# EAGLE design board (EAGLE 9.2.0)
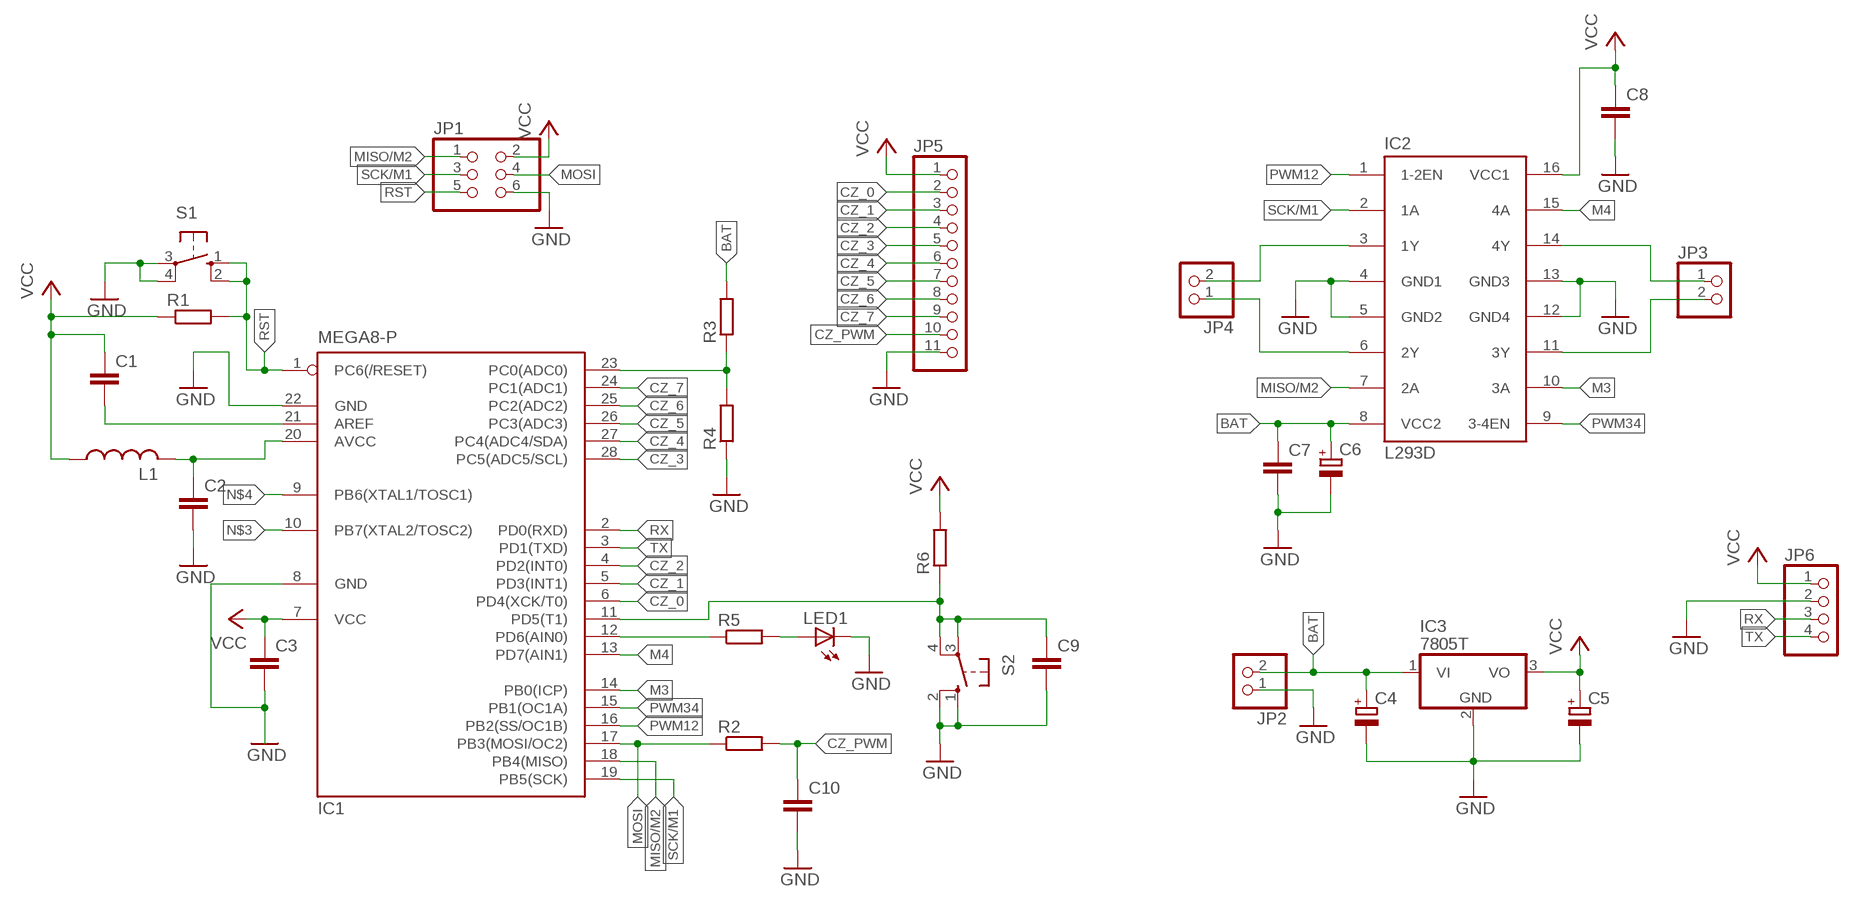
[diagram p0: schematic, sheet 1]

## Parts
C1  C-EU025-025X050  [C025-025X050]
C2  C-EU025-025X050  [C025-025X050]
C3  C-EU025-025X050  [C025-025X050]
C4  CPOL-EUE2-5  [E2-5]
C5  CPOL-EUE2-5  [E2-5]
C6  CPOL-EUE2-5  [E2-5]
C7  C-EU025-025X050  [C025-025X050]
C8  C-EU025-025X050  [C025-025X050]
C9  C-EU025-025X050  [C025-025X050]
C10  C-EU050-035X075  [C050-035X075]
IC1  MEGA8-P  [DIL28-3]
IC2  L293D  [DIL16]
IC3  7805T  [TO220H]
JP1  PINHD-2X3  [2X03]
JP2  PINHD-1X2  [1X02]
JP3  PINHD-1X2  [1X02]
JP4  PINHD-1X2  [1X02]
JP5  PINHD-1X11  [1X11]
JP6  PINHD-1X4  [1X04]
L1  L-US0204/7  [0204/7]
LED1  LED5MM  [LED5MM]
R1  R-EU_0207/7  [0207/7]
R2  R-EU_0207/7  [0207/7]
R3  R-EU_0207/7  [0207/7]
R4  R-EU_0207/7  [0207/7]
R5  R-EU_0207/7  [0207/7]
R6  R-EU_0207/7  [0207/7]
S1  10-XX  [B3F-10XX]
S2  10-XX  [B3F-10XX]

## Nets
BAT: C4.+ C6.+ C7.1 IC2.8(VCC2) IC3.1(VI) JP2.2 R3.2
CZ_0: IC1.6(PD4(XCK/T0)) JP5.2
CZ_1: IC1.5(PD3(INT1)) JP5.3
CZ_2: IC1.4(PD2(INT0)) JP5.4
CZ_3: IC1.28(PC5(ADC5/SCL)) JP5.5
CZ_4: IC1.27(PC4(ADC4/SDA)) JP5.6
CZ_5: IC1.26(PC3(ADC3)) JP5.7
CZ_6: IC1.25(PC2(ADC2)) JP5.8
CZ_7: IC1.24(PC1(ADC1)) JP5.9
CZ_PWM: C10.1 JP5.10 R2.2
GND: C2.2 C3.2 C4.- C5.- C6.- C7.2 C8.2 C9.2 C10.2 IC1.8(GND) IC1.22(GND) IC2.4(GND1) IC2.5(GND2) IC2.12(GND4) IC2.13(GND3) IC3.2(GND) JP1.6 JP2.1 JP5.11 JP6.2 LED1.K(C) R4.1 S1.3(P) S1.4(P1) S2.1(S) S2.2(S1)
M3: IC1.14(PB0(ICP)) IC2.10(3A)
M4: IC1.13(PD7(AIN1)) IC2.15(4A)
MISO/M2: IC1.18(PB4(MISO)) IC2.7(2A) JP1.1
MOSI: IC1.17(PB3(MOSI/OC2)) JP1.4 R2.1
N$1: IC2.11(3Y) JP3.2
N$2: IC2.14(4Y) JP3.1
N$3: IC1.10(PB7(XTAL2/TOSC2))
N$4: IC1.9(PB6(XTAL1/TOSC1))
N$5: C2.1 IC1.20(AVCC) L1.2
N$6: LED1.A R5.2
N$7: IC2.3(1Y) JP4.2
N$8: IC2.6(2Y) JP4.1
N$9: C1.2 IC1.21(AREF)
N$21: IC1.12(PD6(AIN0)) R5.1
N$22: C9.1 IC1.11(PD5(T1)) R6.1 S2.3(P) S2.4(P1)
N$33: IC1.23(PC0(ADC0)) R3.1 R4.2
PWM12: IC1.16(PB2(SS/OC1B)) IC2.1(1-2EN)
PWM34: IC1.15(PB1(OC1A)) IC2.9(3-4EN)
RST: IC1.1(PC6(/RESET)) JP1.5 R1.2 S1.1(S) S1.2(S1)
RX: IC1.2(PD0(RXD)) JP6.3
SCK/M1: IC1.19(PB5(SCK)) IC2.2(1A) JP1.3
TX: IC1.3(PD1(TXD)) JP6.4
VCC: C1.1 C3.1 C5.+ C8.1 IC1.7(VCC) IC2.16(VCC1) IC3.3(VO) JP1.2 JP5.1 JP6.1 L1.1 R1.1 R6.2

## Library data of the parts
C1-C3 C7-C10 = rcl:C-EU: CAPACITOR, European symbol; SPICEPREFIX: C
C4-C6 = rcl:CPOL-EU: POLARIZED CAPACITOR, European symbol; SPICEPREFIX: C
IC1 = atmel:MEGA8-P: MICROCONTROLLER 8 Kbytes FLASH, 1 kbytes SRAM, 512 bytes EEPROM, USART, 4-channel 10 bit ADC, 2-channel 8 bit ADC Pin compatible with Atmega48, ATMega88, ATMega168 Source: avr.lbr; OC_FARNELL: unknown; OC_NEWARK: unknown
IC2 = st-microelectronics:L293D: PUSH-PULL 4 CHANNEL DRIVER; MPN: L293D; OC_FARNELL: 9589619; OC_NEWARK: 56P8249
IC3 = Comparators,LM339:78*: Positive VOLTAGE REGULATOR Source: http://cache.national.com/ds/LM/LM78L05.pdf http://www.fairchildsemi.com/ds/LM/LM7805.pdf
JP1 = pinhead:PINHD-2X3: PIN HEADER
JP2-JP4 = pinhead:PINHD-1X2: PIN HEADER
JP5 = pinhead:PINHD-1X11: PIN HEADER
JP6 = pinhead:PINHD-1X4: PIN HEADER
L1 = rcl:L-US: INDUCTOR, American symbol; SPICEPREFIX: L
LED1 = led:LED: LED OSRAM: - CHIPLED LG R971, LG N971, LY N971, LG Q971, LY Q971, LO R971, LY R971 LH N974, LH R974 LS Q976, LO Q976, LY Q976 LO Q996 - Hyper CHIPLED LW Q18S LB Q993, LB Q99A, LB R99A - SideLED LS A670, LO A670, LY A670, LG A670, LP A670 LB A673, LV A673, LT A673, LW A673 LH A674 LY A675 LS A676, LA A676, LO A676, LY A676, LW A676 LS A679, LY A679, LG A679 - Hyper Micro SIDELED® LS Y876, LA Y876, LO Y876, LY Y876 LT Y87S - SmartLED LW L88C, LW L88S LB L89C, LB L89S, LG L890 LS L89K, LO L89K, LY L89K LS L896, LA L896, LO L896, LY L896 - TOPLED LS T670, LO T670, LY T670, LG T670, LP T670 LSG T670, LSP T670, LSY T670, LOP T670, LYG T670 LG T671, LOG T671, LSG T671 LB T673, LV T673, LT T673, LW T673 LH T674 LS T676, LA T676, LO T676, LY T676, LB T676, LH T676, LSB T676, LW T676 LB T67C, LV T67C, LT T67C, LS T67K, LO T67K, LY T67K, LW E67C LS E67B, LA E67B, LO E67B, LY E67B, LB E67C, LV E67C, LT E67C LW T67C LS T679, LY T679, LG T679 LS T770, LO T770, LY T770, LG T770, LP T770 LB T773, LV T773, LT T773, LW T773 LH T774 LS E675, LA E675, LY E675, LS T675 LS T776, LA T776, LO T776, LY T776, LB T776 LHGB T686 LT T68C, LB T68C - Hyper Mini TOPLED® LB M676 - Mini TOPLED Santana® LG M470 LS M47K, LO M47K, LY M47K Source: http://www.osram.convergy.de LUXEON: - LUMILED® LXK2-PW12-R00, LXK2-PW12-S00, LXK2-PW14-U00, LXK2-PW14-V00 LXK2-PM12-R00, LXK2-PM12-S00, LXK2-PM14-U00 LXK2-PE12-Q00, LXK2-PE12-R00, LXK2-PE12-S00, LXK2-PE14-T00, LXK2-PE14-U00 LXK2-PB12-K00, LXK2-PB12-L00, LXK2-PB12-M00, LXK2-PB14-N00, LXK2-PB14-P00, LXK2-PB14-Q00 LXK2-PR12-L00, LXK2-PR12-M00, LXK2-PR14-Q00, LXK2-PR14-R00 LXK2-PD12-Q00, LXK2-PD12-R00, LXK2-PD12-S00 LXK2-PH12-R00, LXK2-PH12-S00 LXK2-PL12-P00, LXK2-PL12-Q00, LXK2-PL12-R00 Source: www.luxeon.com KINGBRIGHT: KA-3528ASYC Source: www.kingbright.com
R1-R6 = rcl:R-EU_: RESISTOR, European symbol; SPICEPREFIX: R
S1 S2 = switch-omron:10-XX: OMRON SWITCH; MPN: B3F-1000; OC_FARNELL: 176432; OC_NEWARK: 36M3542

## Board
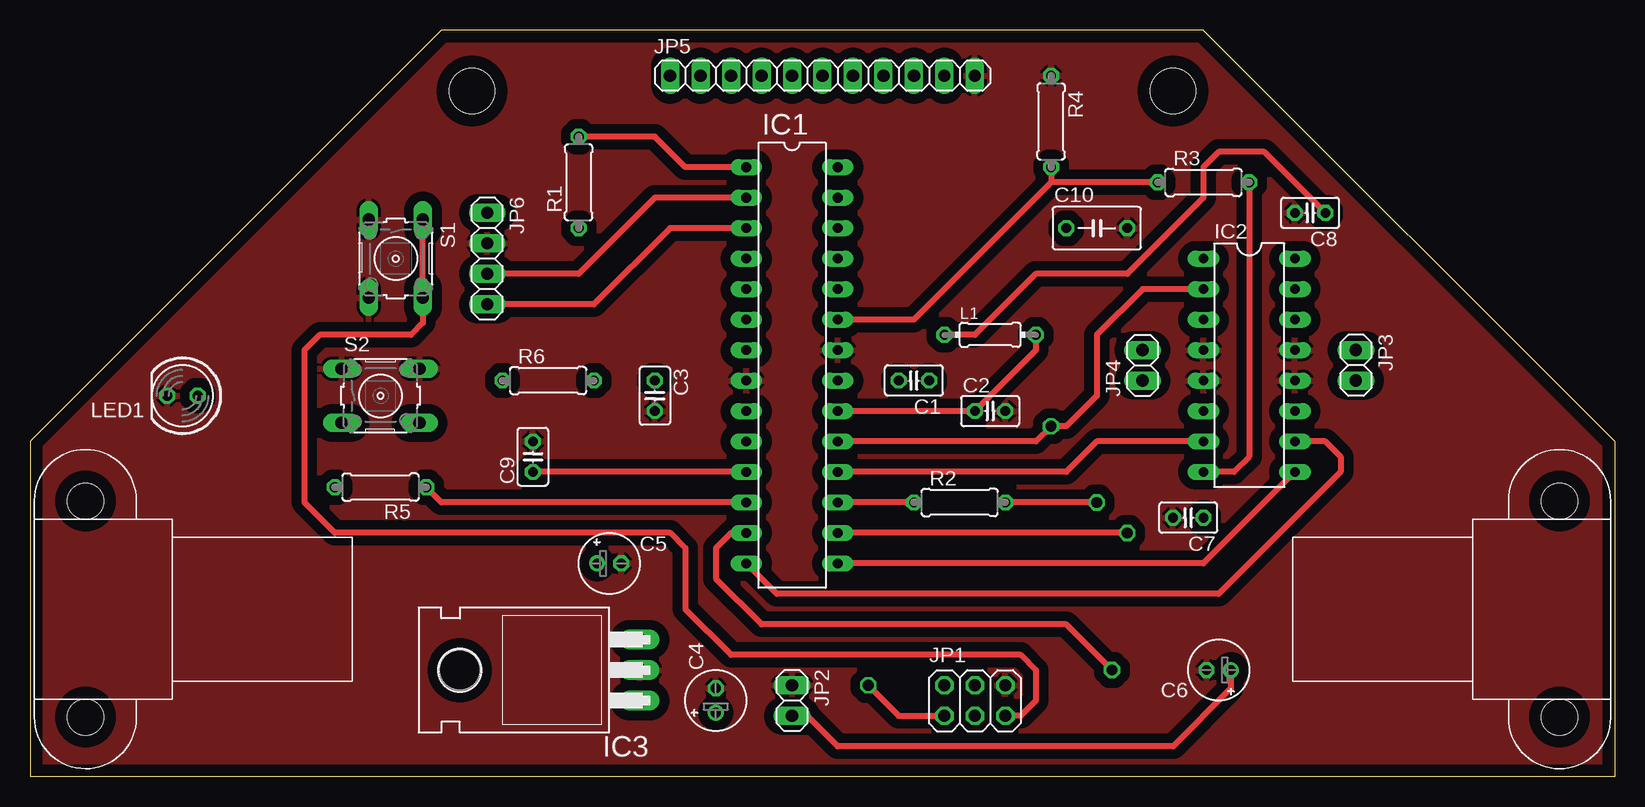
[diagram p1: board, top side]
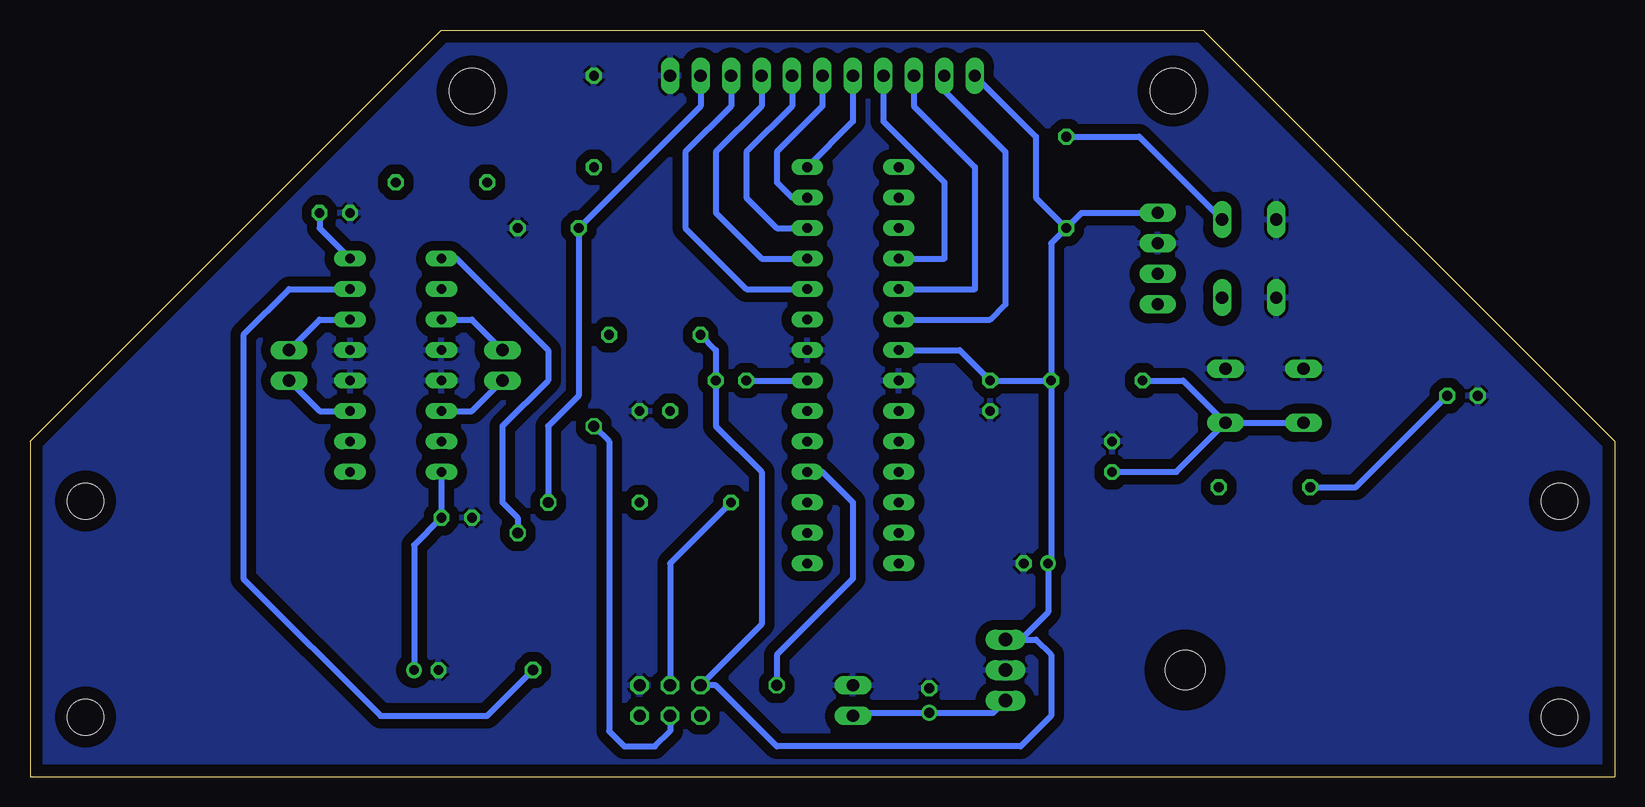
[diagram p2: board, bottom side, seen from below]

Size 132.08 x 62.23 mm. Coordinates in mm from the lower left corner, seen from the top.
Outline: 34.29,62.23 0,27.94 0,0 132.08,0 132.08,27.94 97.79,62.23 34.29,62.23
Copper layers (1*16): Top 0.035mm / dielectric 1.5mm / Bottom 0.035mm
Design rules "default": minimum track width 6mil, minimum drill 0.35mm, track to track 6mil, track to pad 6mil, pad to pad 6mil, via to via 6mil, smd to smd 6mil, copper to edge 40mil, drill to drill 6mil, minimum pad ring 10mil, minimum via ring 8mil, stop-mask expansion 4mil, vias tented up to drill 0mil, thermal gap 10mil
Holes 3.81 mm at 36.83,57.15 95.25,57.15

### Footprints (pad centres in the part's own frame; a part is rotated, then mirrored left to right if it is on the bottom)
C025-025X050 = drill 0.813 octagon: 1 -1.27,0; 2 1.27,0
E2-5 = drill 0.813 pad 1.27: + -1.016,0 | drill 0.813 pad 1.27 octagon: - 1.016,0
C050-035X075 = drill 0.813 octagon: 1 -2.54,0; 2 2.54,0
DIL28-3 = drill 0.813 long: 1 -16.51,-3.81; 2 -13.97,-3.81; 3 -11.43,-3.81; 4 -8.89,-3.81; 5 -6.35,-3.81; 6 -3.81,-3.81; 7 -1.27,-3.81; 8 1.27,-3.81; 9 3.81,-3.81; 10 6.35,-3.81; 11 8.89,-3.81; 12 11.43,-3.81; 13 13.97,-3.81; 14 16.51,-3.81; 15 16.51,3.81; 16 13.97,3.81; 17 11.43,3.81; 18 8.89,3.81; 19 6.35,3.81; 20 3.81,3.81; 21 1.27,3.81; 22 -1.27,3.81; 23 -3.81,3.81; 24 -6.35,3.81; 25 -8.89,3.81; 26 -11.43,3.81; 27 -13.97,3.81; 28 -16.51,3.81
DIL16 = drill 0.813 long: 1 -8.89,-3.81; 2 -6.35,-3.81; 3 -3.81,-3.81; 4 -1.27,-3.81; 5 1.27,-3.81; 6 3.81,-3.81; 7 6.35,-3.81; 8 8.89,-3.81; 9 8.89,3.81; 10 6.35,3.81; 11 3.81,3.81; 12 1.27,3.81; 13 -1.27,3.81; 14 -3.81,3.81; 15 -6.35,3.81; 16 -8.89,3.81
TO220H = drill 1.118 long: 1 -2.54,-10.16; 2 0,-10.16; 3 2.54,-10.16 | hole 3.302: 0,4.826
2X03 = drill 1.016 octagon: 1 -2.54,-1.27; 2 -2.54,1.27; 3 0,-1.27; 4 0,1.27; 5 2.54,-1.27; 6 2.54,1.27
1X02 = drill 1.016 long: 1 -1.27,0; 2 1.27,0
1X11 = drill 1.016 long: 1 -12.7,0; 2 -10.16,0; 3 -7.62,0; 4 -5.08,0; 5 -2.54,0; 6 0,0; 7 2.54,0; 8 5.08,0; 9 7.62,0; 10 10.16,0; 11 12.7,0
1X04 = drill 1.016 long: 1 -3.81,0; 2 -1.27,0; 3 1.27,0; 4 3.81,0
0204/7 = drill 0.813 octagon: 1 -3.81,0; 2 3.81,0
LED5MM = drill 0.813 octagon: A -1.27,0; K 1.27,0
0207/7 = drill 0.813 octagon: 1 -3.81,0; 2 3.81,0
B3F-10XX = drill 1.016 long: 1 -3.251,2.261; 2 3.251,2.261; 3 -3.251,-2.261; 4 3.251,-2.261
HP_NM = hole 3: -9,-3; 9,-3

### Placement (x,y rotation side)
C1  73.66,33.02 180 top
C2  80.01,30.48 0 top
C3  52.07,31.75 270 top
C4  57.15,6.35 90 top
C5  48.26,17.78 0 top
C6  99.06,8.89 180 top
C7  96.52,21.59 180 top
C8  106.68,46.99 180 top
C9  41.91,26.67 90 top
C10  88.9,45.72 0 top
IC1  63.5,34.29 270 top
IC2  101.6,34.29 270 top
IC3  40.64,8.89 90 top
JP1  78.74,6.35 0 top
JP2  63.5,6.35 270 top
JP3  110.49,34.29 270 top
JP4  92.71,34.29 90 top
JP5  66.04,58.42 0 top
JP6  38.1,43.18 270 top
L1  80.01,36.83 0 top
LED1  12.7,31.75 180 top
R1  45.72,49.53 90 top
R2  77.47,22.86 0 top
R3  97.79,49.53 0 top
R4  85.09,54.61 270 top
R5  29.21,24.13 180 top
R6  43.18,33.02 0 top
S1  30.48,43.18 270 top
S2  29.21,31.75 0 top
U$1  [HP_NM]  124.46,13.97 90 top
U$2  [HP_NM]  7.62,13.97 270 top

### Tracks (layer width: path | path; a pad name or v marks a point on that pad's centre or on a via)
BAT
  Top 0.508: JP2.2 64.77,5.08 67.31,2.54 95.25,2.54 100.08,7.37 C6.+ | R3.2 101.6,26.67 100.33,25.4 IC2.8
  Bottom 0.508: IC3.1 51.82,5.33 C4.+ 63.25,5.33 JP2.2 | IC2.8 C7.1 100.08,19.3 C6.+
CZ_0
  Bottom 0.508: JP5.2 55.88,57.15 50.8,52.07 50.8,39.37 52.07,38.1 IC1.6
CZ_1
  Bottom 0.508: IC1.5 53.34,40.64 53.34,50.8 58.42,55.88 JP5.3
CZ_2
  Bottom 0.508: IC1.4 55.88,43.18 55.88,49.53 60.96,54.61 JP5.4
CZ_3
  Bottom 0.508: IC1.28 63.5,54.61 JP5.5
CZ_4
  Bottom 0.508: IC1.27 68.58,48.26 69.85,49.53 69.85,52.07 66.04,55.88 JP5.6
CZ_5
  Bottom 0.508: 68.58,45.72 IC1.26 69.85,45.72 72.39,48.26 72.39,52.07 68.58,55.88 JP5.7
CZ_6
  Bottom 0.508: IC1.25 71.12,43.18 74.93,46.99 74.93,52.07 71.12,55.88 JP5.8
CZ_7
  Bottom 0.508: IC1.24 72.39,40.64 77.47,45.72 77.47,52.07 73.66,55.88 JP5.9
CZ_PWM  (via drill 0.9)
  Top 0.508: v88.9,22.86 R2.2
  Bottom 0.508: v88.9,22.86 88.9,29.21 86.36,31.75 C10.1 76.2,55.88 JP5.10
GND
  pour Bottom (isolate 0.813): 0,27.94 0,0 132.08,0 132.08,27.94 97.79,62.23 34.29,62.23
  pour Top (isolate 0.813): 34.29,62.23 0,27.94 0,0 132.08,0 132.08,27.94 97.79,62.23
M3
  Top 0.508: IC2.10 107.95,27.94 109.22,26.67 109.22,25.4 99.06,15.24 62.23,15.24 IC1.14
M4  (via drill 0.9)
  Top 0.508: IC1.13 58.42,20.32 57.15,19.05 57.15,16.51 60.96,12.7 86.36,12.7 v90.17,8.89
  Bottom 0.508: v90.17,8.89 93.98,5.08 102.87,5.08 114.3,16.51 114.3,36.83 110.49,40.64 IC2.15
MISO/M2  (via drill 0.9)
  Top 0.508: IC1.18 86.36,25.4 88.9,27.94 IC2.7 | v69.85,7.62 72.39,5.08 JP1.1
  Bottom 0.508: IC1.18 66.04,25.4 63.5,22.86 63.5,16.51 69.85,10.16 v69.85,7.62
MOSI
  Top 0.508: R2.1 IC1.17
  Bottom 0.508: R2.1 78.74,17.78 JP1.4
N$1
  Bottom 0.508: IC2.11 107.95,30.48 JP3.2
N$2
  Bottom 0.508: IC2.14 107.95,38.1 JP3.1
N$5
  Top 0.508: L1.2 83.82,35.56 C2.1 IC1.20
N$6
  Bottom 0.508: R5.2 21.59,24.13 LED1.A
N$7
  Bottom 0.508: JP4.2 95.25,38.1 IC2.3
N$8
  Bottom 0.508: JP4.1 95.25,30.48 IC2.6
N$9
  Bottom 0.508: C1.2 IC1.21
N$21
  Top 0.508: R5.1 34.29,22.86 IC1.12
N$22
  Top 0.508: IC1.11 C9.1
  Bottom 0.508: S2.4 36.55,25.4 C9.1 | S2.4 S2.3 | R6.1 35.99,33.02 S2.4
N$33
  Top 0.508: 85.09,49.53 73.66,38.1 IC1.23 | R3.1 85.09,49.53 | R4.2 85.09,49.53
PWM12  (via drill 0.9)
  Top 0.508: v91.44,20.32 IC1.16
  Bottom 0.508: v91.44,20.32 91.44,21.59 92.71,22.86 92.71,29.21 88.9,33.02 88.9,35.56 96.52,43.18 IC2.1
PWM34
  Top 0.508: IC1.15 97.79,17.78 IC2.9
RST
  Top 0.508: IC1.1 54.61,50.8 52.07,53.34 R1.2 | JP1.5 82.55,5.08 83.82,6.35 83.82,8.89 82.55,10.16 58.42,10.16 54.61,13.97 54.61,19.05 53.34,20.32 25.4,20.32 22.86,22.86 22.86,35.56 24.13,36.83 31.75,36.83 32.74,37.82 S1.2 S1.1
  Bottom 0.508: S1.1 39.65,53.34 R1.2
RX
  Top 0.508: IC1.2 52.07,48.26 45.72,41.91 JP6.3
SCK/M1  (via drill 0.9)
  Top 0.508: IC2.2 92.71,40.64 88.9,36.83 88.9,31.75 86.36,29.21 v85.09,29.21 83.82,27.94 IC1.19
  Bottom 0.508: JP1.3 78.74,3.81 80.01,2.54 82.55,2.54 83.82,3.81 83.82,27.94 v85.09,29.21
TX
  Top 0.508: IC1.3 53.34,45.72 46.99,39.37 JP6.4
VCC
  Top 0.508: L1.1 78.74,36.83 83.82,41.91 91.44,41.91 97.79,48.26 97.79,50.8 99.06,52.07 102.87,52.07 C8.1
  Bottom 0.508: IC1.7 54.61,35.56 C3.1 R6.2 | L1.1 74.93,35.56 C1.1 74.93,29.21 71.12,25.4 71.12,12.7 JP1.2 74.93,7.62 69.85,2.54 49.53,2.54 46.99,5.08 46.99,10.16 48.26,11.43 IC3.3 49.53,11.43 47.24,13.72 C5.+ 46.99,18.03 R6.2 | JP5.1 48.26,53.34 48.26,48.26 R1.1 | JP6.1 44.45,46.99 R1.1 | C8.1 107.95,45.72 IC2.16 | R6.2 46.99,44.45 R1.1